# EAGLE design quadcopter_control (EAGLE 5.11)
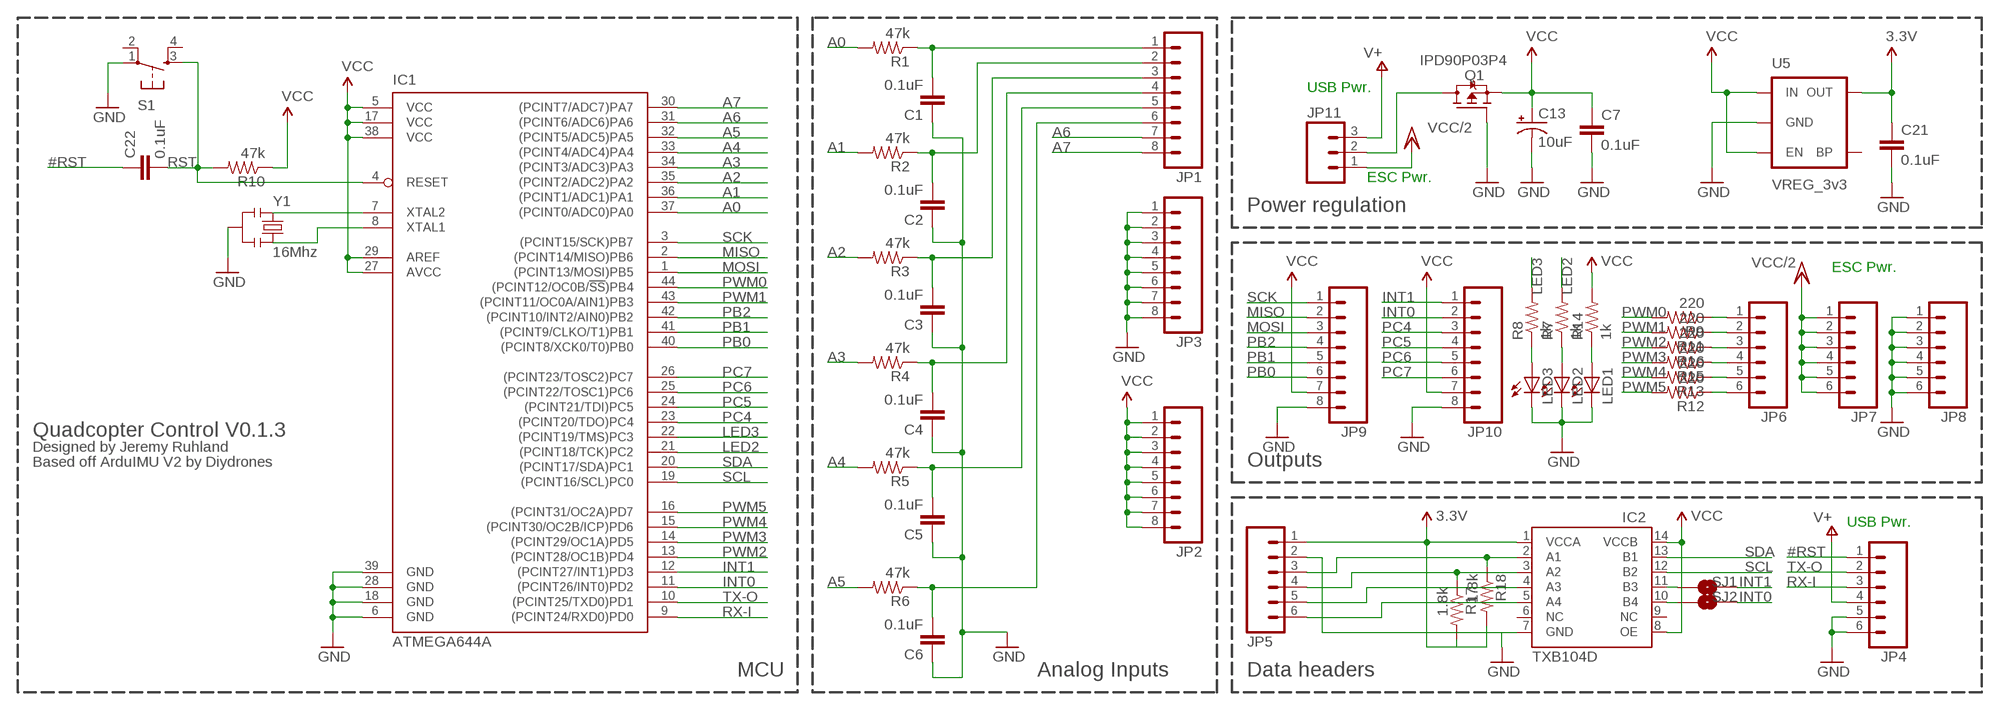
[diagram p0: schematic, sheet 1]

## Parts
C1  0.1uF  CAP0402-CAP  [0402-CAP]
C2  0.1uF  CAP0402-CAP  [0402-CAP]
C3  0.1uF  CAP0402-CAP  [0402-CAP]
C4  0.1uF  CAP0402-CAP  [0402-CAP]
C5  0.1uF  CAP0402-CAP  [0402-CAP]
C6  0.1uF  CAP0402-CAP  [0402-CAP]
C7  0.1uF  CAP0402-CAP  [0402-CAP]
C13  10uF  CAP_POL1206  [EIA3216]
C21  0.1uF  CAP0402-CAP  [0402-CAP]
C22  0.1uF  CAP0402-CAP  [0402-CAP]
IC1  ATMEGA644A  [TQFP44]
IC2  TXB104D  [SOIC(D)-14]
JP1  M081X08  [1X08]
JP2  M081X08  [1X08]
JP3  M081X08  [1X08]
JP4  M06SIP  [1X06]
JP5  M06SIP  [1X06]
JP6  M06SIP  [1X06]
JP7  M06SIP  [1X06]
JP8  M06SIP  [1X06]
JP9  M081X08  [1X08]
JP10  M081X08  [1X08]
JP11  M03LONGPADS  [1X03_LONGPADS]
LED1  LED0603  [LED-0603]
LED2  LED0603  [LED-0603]
LED3  LED0603  [LED-0603]
Q1  IPD90P03P4  FDD4141TO252  [TO252]
R1  47k  RESISTOR0402-RES  [0402-RES]
R2  47k  RESISTOR0402-RES  [0402-RES]
R3  47k  RESISTOR0402-RES  [0402-RES]
R4  47k  RESISTOR0402-RES  [0402-RES]
R5  47k  RESISTOR0402-RES  [0402-RES]
R6  47k  RESISTOR0402-RES  [0402-RES]
R7  1k  RESISTOR0402-RES  [0402-RES]
R8  1k  RESISTOR0402-RES  [0402-RES]
R9  220  RESISTOR0402-RES  [0402-RES]
R10  47k  RESISTOR0402-RES  [0402-RES]
R11  220  RESISTOR0402-RES  [0402-RES]
R12  220  RESISTOR0402-RES  [0402-RES]
R13  220  RESISTOR0402-RES  [0402-RES]
R14  1k  RESISTOR0402-RES  [0402-RES]
R15  220  RESISTOR0402-RES  [0402-RES]
R16  220  RESISTOR0402-RES  [0402-RES]
R17  1.8k  RESISTOR0402-RES  [0402-RES]
R18  1.8k  RESISTOR0402-RES  [0402-RES]
S1  TAC_SWITCHSMD  [TACTILE_SWITCH_SMD]
SJ1  SOLDERJUMPERNC  [SJ_2S]
SJ2  SOLDERJUMPERNC  [SJ_2S]
U5  VREG_3v3  V_REG_LDOSMD  [SOT23-5]
Y1  16Mhz  RESONATORSMD  [RESONATOR-SMD]

## Nets
3.3V: C21.1 IC2.1(VCCA) JP5.1 R17.2 R18.2 U5.5(OUT)
#RST: C22.1 JP4.1
A0: IC1.37((PCINT0/ADC0)PA0) R1.2
A1: IC1.36((PCINT1/ADC1)PA1) R2.2
A2: IC1.35((PCINT2/ADC2)PA2) R3.2
A3: IC1.34((PCINT3/ADC3)PA3) R4.2
A4: IC1.33((PCINT4/ADC4)PA4) R5.2
A5: IC1.32((PCINT5/ADC5)PA5) R6.2
A6: IC1.31((PCINT6/ADC6)PA6) JP1.7
A7: IC1.30((PCINT7/ADC7)PA7) JP1.8
GND: C1.1 C2.1 C3.1 C4.1 C5.1 C6.1 C7.2 C13.C(-) C21.2 IC1.6(GND) IC1.18(GND) IC1.28(GND) IC1.39(GND) IC2.7(GND) JP3.1 JP3.2 JP3.3 JP3.4 JP3.5 JP3.6 JP3.7 JP3.8 JP4.5 JP4.6 JP5.2 JP8.1 JP8.2 JP8.3 JP8.4 JP8.5 JP8.6 JP9.8 JP10.8 LED1.C LED2.C LED3.C Q1.1(G) S1.1 U5.2(GND) Y1.2
INT0: IC1.11((PCINT26/INT0)PD2) JP10.2 SJ2.1
INT1: IC1.12((PCINT27/INT1)PD3) JP10.1 SJ1.1
LED2: IC1.21((PCINT18/TCK)PC2) R7.2
LED3: IC1.22((PCINT19/TMS)PC3) R8.2
MISO: IC1.2((PCINT14/MISO)PB6) JP9.2
MOSI: IC1.1((PCINT13/MOSI)PB5) JP9.3
N$1: C1.2 JP1.1 R1.1
N$2: C2.2 JP1.2 R2.1
N$3: C3.2 JP1.3 R3.1
N$4: C4.2 JP1.4 R4.1
N$5: IC1.8(XTAL1) Y1.3
N$6: C5.2 JP1.5 R5.1
N$7: IC1.7(XTAL2) Y1.1
N$8: C6.2 JP1.6 R6.1
N$9: LED2.A R7.1
N$10: LED3.A R8.1
N$11: JP11.2 Q1.2(D)
N$12: IC2.5(A4) JP5.6
N$13: JP6.3 R16.1
N$14: IC2.4(A3) JP5.5
N$15: IC2.11(B3) SJ1.2
N$16: IC2.10(B4) SJ2.2
N$17: LED1.A R14.1
N$20: IC2.3(A2) JP5.4 R17.1
N$21: IC2.2(A1) JP5.3 R18.1
N$25: JP6.4 R15.1
N$26: JP6.5 R13.1
N$27: JP6.6 R12.1
N$28: JP6.2 R11.1
N$29: JP6.1 R9.1
PB0: IC1.40((PCINT8/XCK0/T0)PB0) JP9.6
PB1: IC1.41((PCINT9/CLKO/T1)PB1) JP9.5
PB2: IC1.42((PCINT10/INT2/AIN0)PB2) JP9.4
PC4: IC1.23((PCINT20/TDO)PC4) JP10.3
PC5: IC1.24((PCINT21/TDI)PC5) JP10.4
PC6: IC1.25((PCINT22/TOSC1)PC6) JP10.5
PC7: IC1.26((PCINT23/TOSC2)PC7) JP10.6
PWM0: IC1.44((PCINT12/OC0B/!SS!)PB4) R9.2
PWM1: IC1.43((PCINT11/OC0A/AIN1)PB3) R11.2
PWM2: IC1.13((PCINT28/OC1B)PD4) R16.2
PWM3: IC1.14((PCINT29/OC1A)PD5) R15.2
PWM4: IC1.15((PCINT30/OC2B/ICP)PD6) R13.2
PWM5: IC1.16((PCINT31/OC2A)PD7) R12.2
RST: C22.2 IC1.4(RESET) R10.2 S1.3
RX-I: IC1.9((PCINT24/RXD0)PD0) JP4.3
SCK: IC1.3((PCINT15/SCK)PB7) JP9.1
SCL: IC1.19((PCINT16/SCL)PC0) IC2.12(B2)
SDA: IC1.20((PCINT17/SDA)PC1) IC2.13(B1)
TX-O: IC1.10((PCINT25/TXD0)PD1) JP4.2
V+: JP4.4 JP11.3
VCC: C7.1 C13.A(+) IC1.5(VCC) IC1.17(VCC) IC1.27(AVCC) IC1.29(AREF) IC1.38(VCC) IC2.8(OE) IC2.14(VCCB) JP2.1 JP2.2 JP2.3 JP2.4 JP2.5 JP2.6 JP2.7 JP2.8 JP9.7 JP10.7 Q1.3(S) R10.1 R14.2 U5.1(IN) U5.3(EN)
VCC/2: JP7.1 JP7.2 JP7.3 JP7.4 JP7.5 JP7.6 JP11.1
Unconnected: IC2.6(NC) IC2.9(NC) S1.2 S1.4 U5.4(BP)

## Notes on the sheet
- USB Pwr.
- ESC Pwr.
- Power regulation
- ESC Pwr.
- Quadcopter Control V0.1.3
- Designed by Jeremy Ruhland
- Based off ArduIMU V2 by Diydrones | Outputs
- USB Pwr.
- MCU | Analog Inputs | Data headers

## Library data of the parts
C1-C7 C21 C22 = SparkFun:CAP: Capacitor Standard 0603 ceramic capacitor, and 0.1" leaded capacitor.
C13 = SparkFun:CAP_POL: Capacitor Polarized These are standard SMD and PTH capacitors. Normally 10uF, 47uF, and 100uF in electrolytic and tantalum varieties. Always verify the external diameter of the through hole cap, it varies with capacity, voltage, and manufacturer. The EIA devices should be standard.
IC1 = atmel:ATMEGA644: 8-bit Microcontroller with 64K Bytes In-System Programmable Flash Source: http://www.atmel.com/dyn/resources/prod_documents/doc2593.pdf; MPN: ATMEGA644PV-10AU; OC_FARNELL: 1455123; OC_NEWARK: 58M3748
IC2 = ti_txb0104:TXB104
JP1-JP3 JP9 JP10 = SparkFun:M08: Header 8 Standard 8-pin 0.1" header. Use with straight break away headers (SKU : PRT-00116), right angle break away headers (PRT-00553), swiss pins (PRT-00743), machine pins (PRT-00117), and female headers (PRT-00115).
JP4-JP8 = SparkFun:M06: Header 6 Standard 6-pin 0.1" header. Use with straight break away headers (SKU : PRT-00116), right angle break away headers (PRT-00553), swiss pins (PRT-00743), machine pins (PRT-00117), and female headers (PRT-00115). Molex polarized connector foot print use with SKU : PRT-08094 with associated crimp pins and housings. NOTES ON THE VARIANTS LOCK and LOCK_LONGPADS... This footprint was designed to help hold the alignment of a through-hole component (i.e. 6-pin header) while soldering it into place. You may notice that each hole has been shifted either up or down by 0.005 of an inch from it's more standard position (which is a perfectly straight line). This slight alteration caused the pins (the squares in the middle) to touch the edges of the holes. Because they are alternating, it causes a "brace" to hold the component in place. 0.005 has proven to be the perfect amount of "off-center" position when using our standard breakaway headers. Although looks a little odd when you look at the bare footprint, once you have a header in there, the alteration is very hard to notice. Also, if you push a header all the way into place, it is covered up entirely on the bottom side. This idea of altering the position of holes to aid alignment will be further integrated into the Sparkfun Library for other footprints. It can help hold any component with 3 or more connection pins.
JP11 = SparkFun:M03: Header 3 Standard 3-pin 0.1" header. Use with straight break away headers (SKU : PRT-00116), right angle break away headers (PRT-00553), swiss pins (PRT-00743), machine pins (PRT-00117), and female headers (PRT-00115). Molex polarized connector foot print use with SKU : PRT-08232 with associated crimp pins and housings.
LED1-LED3 = DIYdrones3:LED: LEDs Standard schematic elements and footprints for 5mm, 3mm, 1206, and 0603 sized LEDs. 5mm - Spark Fun Electronics SKU : COM-00529 (and others)
Q1 = transistor-fet:FDD4141: P-Channel PowerTrench® MOSFET Source: FDD4141.pdf
R1-R18 = SparkFun:RESISTOR: Resistor Basic schematic elements and footprints for 0603, 1206, and PTH resistors.
S1 = SparkFun:TAC_SWITCH: Momentary Switch Button commonly used for reset or general input. Spark Fun Electronics SKU : COM-00097
SJ1 SJ2 = SparkFun:SOLDERJUMPER: Solder Jumper Standard SMD solder jumper. Used to automate production. Two varients : Normally Open and Normally Closed are the same, but have different paste layers. NC will have a large amount of paste and should jumper during reflow.
U5 = DIYdrones3:V_REG_LDO: Voltage Regulator LDO Standard 150mA LDO voltage regulator in SOT-23 layout. Micrel part MIC5205. BP (by-pass) pin is used to lower output noise with 470pF cap.
Y1 = DIYdrones3:RESONATOR: Resonator Small SMD resonator. This is the itty bitty 10/20MHz resonators with built in caps. CSTCE10M0G55 and CSTCE20M0V53. Footprint has been reviewed closely but hasn't been tested yet.

## Board
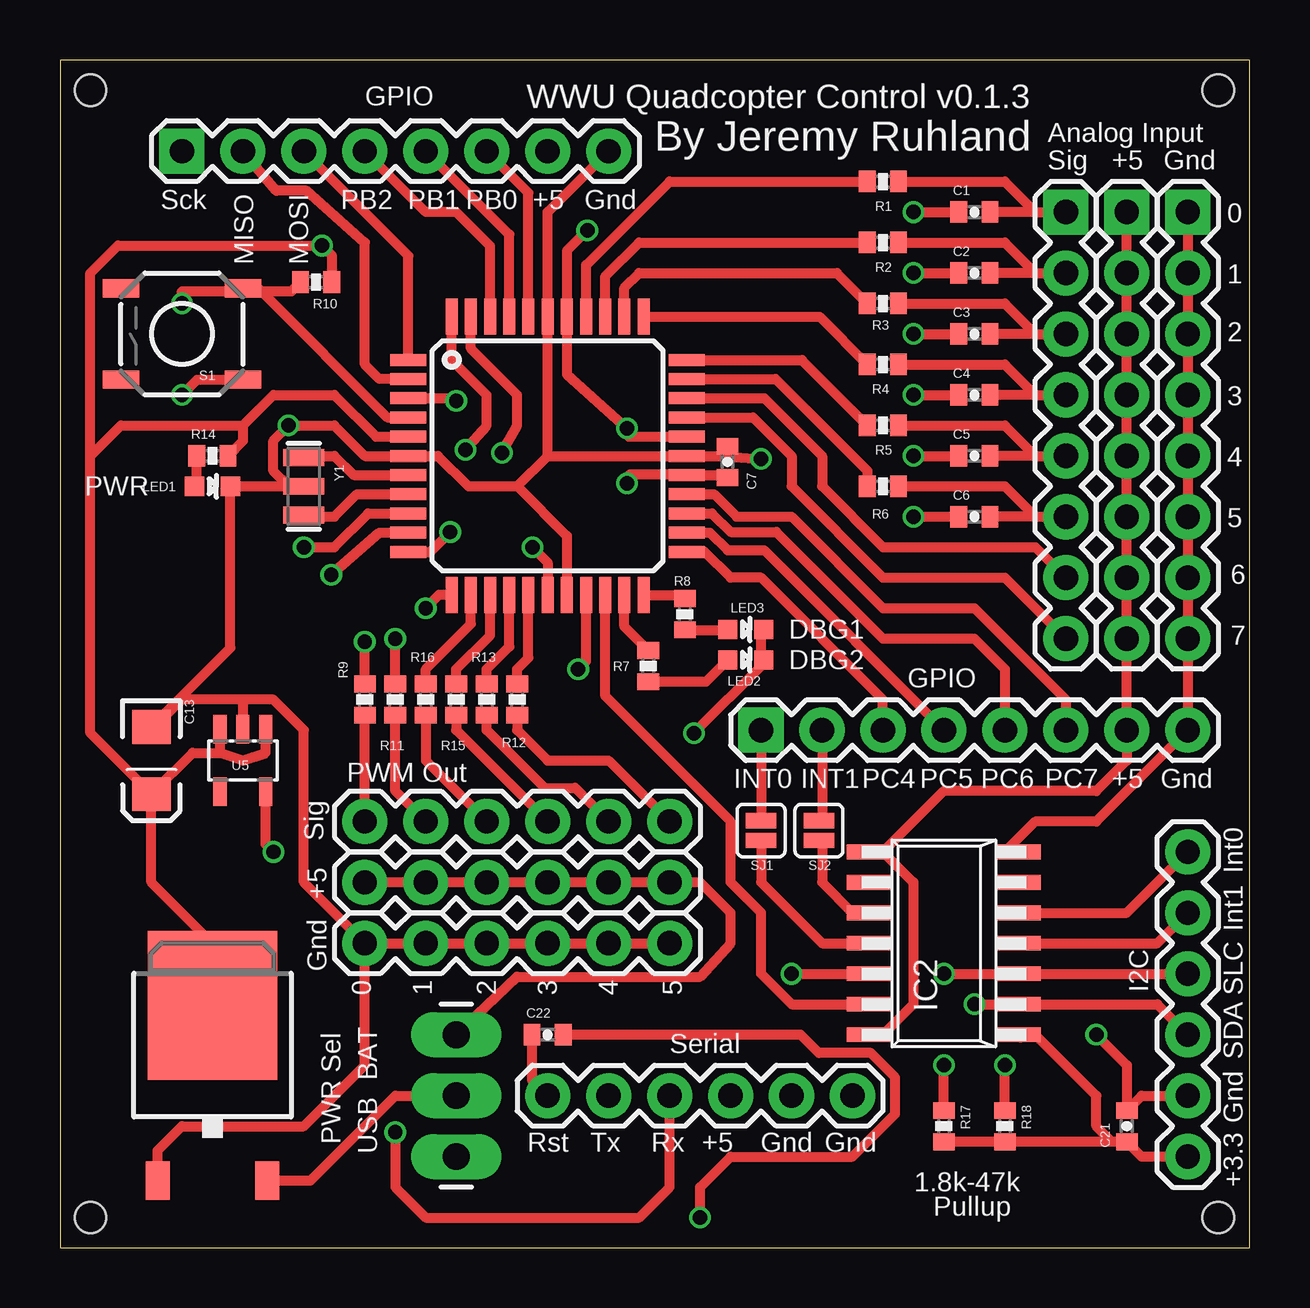
[diagram p1: board, top side]
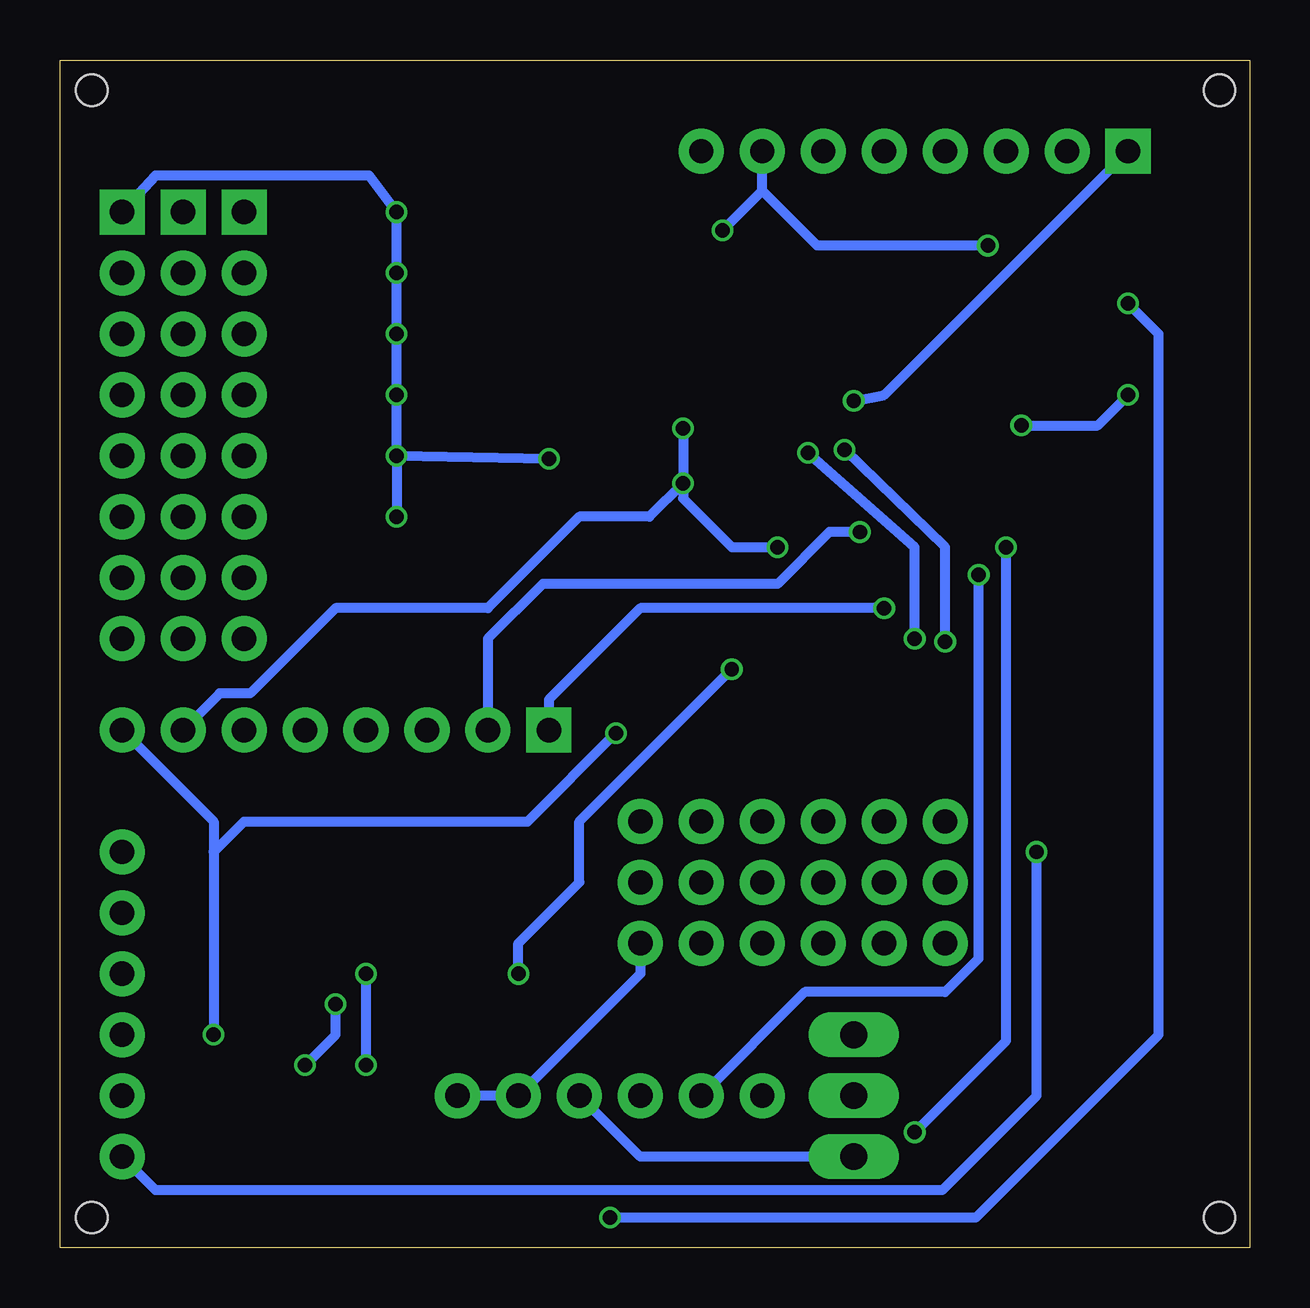
[diagram p2: board, bottom side, seen from below]

Size 49.58 x 49.52 mm. Coordinates in mm from the lower left corner, seen from the top.
Outline: 0,0 49.58,0 49.58,49.52 0,49.52 0,0
Copper layers (1*16): Top 0.035mm / dielectric 1.5mm / Bottom 0.035mm
Design rules "ITead_rule": minimum track width 6mil, minimum drill 12mil, track to track 6mil, track to pad 6mil, pad to pad 6mil, via to via 6mil, smd to smd 0mil, copper to edge 10mil, drill to drill 10mil, minimum pad ring 10mil, minimum via ring 6mil, stop-mask expansion 2mil, vias tented up to drill 100mil, thermal gap 10mil
Holes 1.3 mm at 1.27,48.26 48.26,48.26 48.26,1.27 1.27,1.27

### Footprints (pad centres in the part's own frame; a part is rotated, then mirrored left to right if it is on the bottom)
0402-CAP = smd 0.7 x 0.9: 1 -0.65,0; 2 0.65,0
EIA3216 = smd 1.4 x 1.6: A 1.4,0; C -1.4,0
TQFP44 = smd 1.5 x 0.5: 1 -5.8,4; 2 -5.8,3.2; 3 -5.8,2.4; 4 -5.8,1.6; 5 -5.8,0.8; 6 -5.8,0; 7 -5.8,-0.8; 8 -5.8,-1.6; 9 -5.8,-2.4; 10 -5.8,-3.2; 11 -5.8,-4; 23 5.8,-4; 24 5.8,-3.2; 25 5.8,-2.4; 26 5.8,-1.6; 27 5.8,-0.8; 28 5.8,0; 29 5.8,0.8; 30 5.8,1.6; 31 5.8,2.4; 32 5.8,3.2; 33 5.8,4 | smd 0.5 x 1.5: 12 -4,-5.8; 13 -3.2,-5.8; 14 -2.4,-5.8; 15 -1.6,-5.8; 16 -0.8,-5.8; 17 0,-5.8; 18 0.8,-5.8; 19 1.6,-5.8; 20 2.4,-5.8; 21 3.2,-5.8; 22 4,-5.8; 34 4,5.8; 35 3.2,5.8; 36 2.4,5.8; 37 1.6,5.8; 38 0.8,5.8; 39 0,5.8; 40 -0.8,5.8; 41 -1.6,5.8; 42 -2.4,5.8; 43 -3.2,5.8; 44 -4,5.8
SOIC(D)-14 = smd 0.61 x 1.93: 1 -3.81,-3.076; 2 -2.54,-3.076; 3 -1.27,-3.076; 4 0,-3.076; 5 1.27,-3.076; 6 2.54,-3.076; 7 3.81,-3.076; 8 3.81,3.076; 9 2.54,3.076; 10 1.27,3.076; 11 0,3.076; 12 -1.27,3.076; 13 -2.54,3.076; 14 -3.81,3.076
1X08 = drill 1.016 pad 1.88 square: 1 0,0 | drill 1.016 pad 1.88 round: 2 2.54,0; 3 5.08,0; 4 7.62,0; 5 10.16,0; 6 12.7,0; 7 15.24,0; 8 17.78,0
1X06 = drill 1.016 pad 1.88 round: 1 0,0; 2 2.54,0; 3 5.08,0; 4 7.62,0; 5 10.16,0; 6 12.7,0
1X03_LONGPADS = drill 1.118 pad 1.88 long: 1 0,0; 2 2.54,0; 3 5.08,0
LED-0603 = smd 0.8 x 0.8: A 0,-0.75; C 0,0.75
TO252 = smd 1 x 1.6: 1 -2.28,-4.8; 2 2.28,-4.8 | smd 5.4 x 6.2: 3 0,2.5
0402-RES = smd 0.7 x 0.9: 1 -0.65,0; 2 0.65,0
TACTILE_SWITCH_SMD = smd 1.524 x 0.762: 1 -2.54,1.905; 2 2.54,1.905; 3 -2.54,-1.905; 4 2.54,-1.905
SJ_2S = smd 0.635 x 1.27: 1 -0.412,0; 2 0.412,0
SOT23-5 = smd 0.55 x 1.2: 1 -0.95,-1.3; 2 0,-1.3; 3 0.95,-1.3; 4 0.95,1.3; 5 -0.95,1.3
RESONATOR-SMD = smd 0.7 x 1.7: 1 -1.2,0; 2 0,0; 3 1.2,0

### Placement (x,y rotation side)
C1  38.1,43.18 0 top
C2  38.1,40.64 0 top
C3  38.1,38.1 0 top
C4  38.1,35.56 0 top
C5  38.1,33.02 0 top
C6  38.1,30.48 0 top
C7  27.81,32.77 90 top
C13  3.81,20.32 270 top
C21  44.45,5.08 90 top
C22  20.32,8.89 0 top
IC1  20.32,33.02 0 top
IC2  36.83,12.7 90 top
JP1  41.91,43.18 270 top
JP2  44.45,43.18 270 top
JP3  46.99,43.18 270 top
JP4  20.32,6.35 0 top
JP5  46.99,3.81 90 top
JP6  12.7,17.78 0 top
JP7  12.7,15.24 0 top
JP8  12.7,12.7 0 top
JP9  5.08,45.72 0 top
JP10  29.21,21.59 0 top
JP11  16.51,8.89 270 top
LED1  6.35,31.75 270 top
LED2  28.57,24.51 270 top
LED3  28.57,25.78 270 top
Q1  6.35,7.62 0 top
R1  34.29,44.45 180 top
R2  34.29,41.91 180 top
R3  34.29,39.37 180 top
R4  34.29,36.83 180 top
R5  34.29,34.29 180 top
R6  34.29,31.75 180 top
R7  24.51,24.26 90 top
R8  26.04,26.42 90 top
R9  12.7,22.86 90 top
R10  10.67,40.26 180 top
R11  13.97,22.86 90 top
R12  19.05,22.86 90 top
R13  17.78,22.86 90 top
R14  6.35,33.02 0 top
R15  16.51,22.86 90 top
R16  15.24,22.86 90 top
R17  36.83,5.08 270 top
R18  39.37,5.08 270 top
S1  5.08,38.1 180 top
SJ1  29.21,17.4 270 top
SJ2  31.62,17.4 270 top
U5  7.62,20.32 180 top
Y1  10.16,31.75 270 top

### Tracks (layer width: path | path; a pad name or v marks a point on that pad's centre or on a via)
3.3V  (via drill 0.6)
  Top 0.406: U5.5 8.57,16.83 v8.89,16.51 | 40.02,8.78 IC2.1 40.64,8.89 43.18,6.35 43.18,5.08 43.83,4.43 C21.1 | C21.1 45.07,3.81 JP5.1 | R18.2 R17.2 | R18.2 39.37,4.45 | C21.1 44.45,4.45 44.44,4.43 R18.2
  Bottom 0.406: v8.89,16.51 8.89,6.35 12.83,2.41 45.59,2.41 JP5.1
#RST
  Top 0.406: JP4.1 19.67,7 C22.1
A0
  Top 0.406: IC1.37 21.92,40.97 25.4,44.45 R1.2
A1
  Top 0.406: IC1.36 22.72,40.5 24.13,41.91 R2.2
A2
  Top 0.406: IC1.35 23.52,40.03 24.13,40.64 32.37,40.64 R3.2
A3
  Top 0.406: IC1.34 31.65,38.82 R4.2
A4
  Top 0.406: IC1.33 30.91,37.02 R5.2
A5
  Top 0.406: IC1.32 29.82,36.22 33.64,32.4 R6.2
A6
  Top 0.406: IC1.31 29.35,35.42 31.75,33.02 31.75,31.75 34.29,29.21 40.64,29.21 JP1.7
A7
  Top 0.406: IC1.30 28.88,34.62 30.48,33.02 30.48,31.75 34.29,27.94 39.37,27.94 JP1.8
GND  (via drill 0.6)
  Top 0.406: JP3.1 JP3.2 JP3.3 JP3.4 JP3.5 JP3.6 JP3.7 JP3.8 JP10.8 43.18,17.78 40.64,17.78 39.37,16.51 IC2.7 | JP8.1 JP8.2 JP8.3 JP8.4 JP8.5 JP8.6 | 7.62,22.86 U5.2 | 4.95,22.86 C13.C | 7.62,22.86 4.95,22.86 | 7.62,22.86 8.89,22.86 10.16,21.59 10.16,15.24 JP8.1 | 20.32,33.02 IC1.39 20.32,43.18 JP9.8 | 19.05,31.75 20.32,33.02 | 19.05,31.75 17.02,31.75 15.75,33.02 IC1.6 12.7,33.02 11.43,34.29 v9.53,34.29 8.89,33.66 8.89,32.38 9.53,31.75 Y1.2 LED1.C 7.1,25.01 C13.C | 20.32,33.02 IC1.28 27.54,33.02 | 27.54,33.02 C7.2 | v35.56,30.48 C6.1 | v35.56,33.02 C5.1 | v35.56,35.56 C4.1 | v35.56,38.1 C3.1 | v35.56,40.64 C2.1 | 27.54,33.02 v29.21,32.89 | S1.1 5.71,36.2 v5.08,35.56 | Q1.1 4.07,4.07 5.08,5.08 10.16,5.08 12.7,7.62 JP8.1 | v35.56,43.18 C1.1 | IC1.18 21.12,29.68 19.05,31.75 | v43.18,8.89 44.45,7.62 C21.2 45.07,6.35 JP5.2 | 4.95,22.86 4.95,22.73 3.81,21.59 C13.C | LED3.C 29.21,25.67 29.21,24.63 LED2.C 29.32,24.37 v26.42,21.46
  Bottom 0.406: v35.56,33.02 v35.56,30.48 | v35.56,33.02 v35.56,35.56 v35.56,38.1 v35.56,40.64 v35.56,43.18 36.7,44.7 45.59,44.7 JP3.1 | v29.21,32.89 v35.56,33.02 | v9.53,34.29 6.35,34.29 v5.08,35.56 | JP4.6 JP4.5 25.4,11.43 JP8.6 | 43.18,16.51 43.18,17.78 JP10.8 | 43.18,16.51 v43.18,8.89 | 43.18,16.51 41.91,17.78 30.1,17.78 v26.42,21.46
INT0  (via drill 0.6)
  Top 0.406: SJ2.1 31.75,17.81 JP10.2 | IC1.11 15.43,29.02 v16.26,29.84
  Bottom 0.406: v16.26,29.84 17.53,29.84 19.68,27.69 29.46,27.69 31.75,25.4 JP10.2
INT1  (via drill 0.6)
  Top 0.406: JP10.1 SJ1.1 | IC1.12 15.79,27.22 v15.24,26.67
  Bottom 0.406: v15.24,26.67 25.4,26.67 29.21,22.86 JP10.1
LED2
  Top 0.406: IC1.21 23.52,25.9 R7.2
LED3
  Top 0.406: IC1.22 25.88,27.22 R8.2
MISO
  Top 0.406: IC1.2 13.31,36.22 12.7,36.83 12.7,41.91 10.29,44.07 9.02,44.07 JP9.2
MOSI
  Top 0.406: IC1.1 14.52,41.36 JP9.3
N$1
  Top 0.406: 40.64,43.18 C1.2 | 40.64,43.18 JP1.1 | R1.1 39.37,44.45 40.64,43.18
N$2
  Top 0.406: 40.64,40.64 C2.2 | 40.64,40.64 JP1.2 | R2.1 39.37,41.91 40.64,40.64
N$3
  Top 0.406: 40.64,38.1 C3.2 | 40.64,38.1 JP1.3 | R3.1 39.37,39.37 40.64,38.1
N$4
  Top 0.406: 40.64,35.56 C4.2 | 40.64,35.56 JP1.4 | R4.1 39.37,36.83 40.64,35.56
N$5
  Top 0.406: IC1.8 12.37,31.42 11.43,30.48 10.23,30.48 Y1.3
N$6
  Top 0.406: 40.64,33.02 C5.2 | 40.64,33.02 JP1.5 | R5.1 39.37,34.29 40.64,33.02
N$7
  Top 0.406: IC1.7 12.23,32.22 11.43,33.02 10.23,33.02 Y1.1
N$8
  Top 0.406: 40.64,30.48 C6.2 | 40.64,30.48 JP1.6 | R6.1 39.37,31.75 40.64,30.48
N$9
  Top 0.406: R7.1 26.92,23.61 LED2.A
N$10
  Top 0.406: R8.1 27.81,25.77 LED3.A
N$11
  Top 0.406: Q1.2 10.44,2.82 13.97,6.35 JP11.2
N$12
  Top 0.406: JP5.6 44.45,13.97 IC2.5
N$13
  Top 0.406: JP6.3 15.24,20.32 R16.1
N$14
  Top 0.406: IC2.4 45.72,12.7 JP5.5
N$15
  Top 0.406: IC2.11 31.75,12.7 29.21,15.24 SJ1.2
N$16
  Top 0.406: IC2.10 33.02,13.97 31.75,15.24 31.75,16.86 SJ2.2
N$17
  Top 0.406: R14.1 5.7,31.85 LED1.A
N$20  (via drill 0.6)
  Top 0.406: JP5.4 IC2.3 v36.83,11.43 | R17.1 v36.83,7.62
  Bottom 0.406: v36.83,7.62 v36.83,11.43
N$21  (via drill 0.6)
  Top 0.406: JP5.3 45.72,10.16 IC2.2 v38.1,10.16 | 39.37,5.71 R18.1 v39.37,7.62
  Bottom 0.406: v38.1,10.16 38.1,8.89 v39.37,7.62
N$25
  Top 0.406: JP6.4 16.51,21.59 R15.1
N$26
  Top 0.406: R13.1 17.78,21.59 20.19,19.18 21.46,19.18 JP6.5
N$27
  Top 0.406: JP6.6 22.86,20.32 20.32,20.32 19.05,21.59 R12.1
N$28
  Top 0.406: JP6.2 13.97,19.05 R11.1
N$29
  Top 0.406: JP6.1 R9.1
PB0
  Top 0.406: IC1.40 19.52,43.98 JP9.6
PB1
  Top 0.406: IC1.41 18.72,42.24 JP9.5
PB2
  Top 0.406: IC1.42 17.92,41.77 16.51,43.18 15.24,43.18 JP9.4
PC4
  Top 0.406: JP10.3 34.29,22.86 29.21,27.94 27.94,27.94 26.86,29.02 IC1.23
PC5
  Top 0.406: JP10.4 29.34,29.08 27.81,29.08 27.08,29.82 IC1.24
PC6
  Top 0.406: JP10.5 39.37,24.13 38.1,25.4 34.29,25.4 29.84,29.84 27.94,29.84 27.16,30.62 IC1.25
PC7
  Top 0.406: JP10.6 41.91,22.86 38.1,26.67 34.29,26.67 30.48,30.48 28.19,30.48 27.25,31.42 IC1.26
PWM0  (via drill 0.6)
  Top 0.406: R9.2 v12.7,25.27 | v16.89,33.27 17.78,34.29 17.78,35.56 16.32,37.02 IC1.44
  Bottom 0.406: v12.7,25.27 12.7,29.21 v16.89,33.27
PWM1  (via drill 0.6)
  Top 0.406: R11.2 v13.97,25.4 | v18.41,33.15 19.05,34.29 19.05,35.56 17.12,37.49 IC1.43
  Bottom 0.406: v13.97,25.4 13.97,29.21 v18.41,33.15
PWM2
  Top 0.406: IC1.13 17.12,26.01 15.24,24.13 R16.2
PWM3
  Top 0.406: IC1.14 17.92,25.54 16.51,24.13 R15.2
PWM4
  Top 0.406: IC1.15 18.72,25.07 17.78,24.13 R13.2
PWM5
  Top 0.406: IC1.16 19.52,24.6 19.05,24.13 R12.2
RST  (via drill 0.6)
  Top 0.406: 8.38,39.88 8.26,40.01 S1.3 | IC1.4 13.64,34.62 8.38,39.88 | 8.38,39.88 5.08,39.88 v5.08,39.37 | 8.38,39.88 9.64,39.88 R10.2 | v26.67,1.27 26.67,2.54 27.94,3.81 33.02,3.81 34.8,5.59 34.8,7.11 33.78,8.13 31.62,8.13 30.86,8.89 C22.2
  Bottom 0.406: v5.08,39.37 3.81,38.1 3.81,8.89 11.43,1.27 v26.67,1.27
RX-I  (via drill 0.6)
  Top 0.406: IC1.9 12.84,30.62 11.43,29.21 v10.16,29.21 | v13.97,4.83 13.97,2.54 15.24,1.27 24.13,1.27 25.4,2.54 JP4.3
  Bottom 0.406: v10.16,29.21 10.16,8.64 v13.97,4.83
SCK  (via drill 0.6)
  Top 0.406: IC1.3 16.37,35.42 v16.51,35.31
  Bottom 0.406: v16.51,35.31 15.24,35.56 JP9.1
SCL  (via drill 0.6)
  Top 0.406: v21.59,24.13 21.92,24.46 IC1.19 | v30.48,11.43 IC2.12
  Bottom 0.406: v21.59,24.13 27.94,17.78 27.94,15.24 30.48,12.7 v30.48,11.43
SDA
  Top 0.406: IC1.20 22.72,23 27.94,17.78 27.94,15.24 29.21,13.97 29.21,11.43 30.48,10.16 IC2.13
TX-O  (via drill 0.6)
  Top 0.406: IC1.10 13.31,29.82 v11.3,28.07
  Bottom 0.406: v11.3,28.07 11.3,12.06 12.7,10.67 18.54,10.67 JP4.2
V+
  Bottom 0.406: JP11.3 25.4,3.81 JP4.4
VCC  (via drill 0.6)
  Top 0.406: JP2.1 JP2.2 JP2.3 JP2.4 JP2.5 JP2.6 JP2.7 JP2.8 JP10.7 44.45,20.32 43.18,19.05 36.83,19.05 34.29,16.51 | 6.67,20.64 U5.3 | 6.67,20.64 7.62,20.32 8.57,20.64 U5.1 | C13.A 5.53,20.64 6.67,20.64 | IC1.29 23.71,33.82 v23.62,34.16 21.12,36.41 IC1.38 21.12,41.57 v21.97,42.42 | v23.62,31.88 23.75,32.26 26.08,32.26 IC1.27 27.58,32.22 C7.1 | C13.A 3.81,15.24 6.35,12.7 Q1.3 6.35,8.89 | IC1.17 20.32,28.57 v19.68,29.21 | IC1.5 13.17,33.82 11.43,35.56 8.89,35.56 7.62,34.29 | 7.62,34.29 7.62,33.64 R14.2 | 1.27,33.02 2.54,34.29 7.62,34.29 | 1.27,33.02 1.27,21.46 C13.A | 1.27,33.02 1.27,40.64 2.41,41.78 v10.92,41.78 11.32,41.39 R10.1 | 34.29,16.51 IC2.8 | 34.29,16.51 35.56,15.24 35.56,10.16 34.29,8.89 IC2.14
  Bottom 0.406: v23.62,34.16 v23.62,31.88 | v23.62,31.88 25.02,30.48 27.94,30.48 31.75,26.67 38.1,26.67 41.66,23.11 42.93,23.11 JP10.7 | v23.62,31.88 23.62,31.24 21.59,29.21 v19.68,29.21 | 20.32,44.07 v21.97,42.42 | 20.32,44.07 JP9.7 | v10.92,41.78 18.03,41.78 20.32,44.07
VCC/2
  Top 0.406: JP11.1 19.05,11.3 26.67,11.3 27.94,12.7 27.94,13.97 26.67,15.24 JP7.6 JP7.5 JP7.4 JP7.3 JP7.2 JP7.1

### Text on the board
_tsilk: GPIO | WWU Quadcopter Control v0.1.3 | By Jeremy Ruhland | Analog Input | Sig | +5 | Gnd | MISO | MOSI | 0 | Sck | PB2 | PB1 | PB0 | +5 | Gnd | 1 | 2 | 3 | 4 | PWR | 5 | 6 | DBG1 | 7 | DBG2 | GPIO | Sig | PWM Out | INT0 | INT1 | PC4 | PC5 | PC6 | PC7 | +5 | Gnd | +5 | Int0 | Gnd | Int1 | 0 | 1 | 2 | 3 | 4 | 5 | I2C | SLC | Serial | SDA | BAT | Rst | Tx | Rx | +5 | Gnd | Gnd | Gnd | PWR Sel | USB | 1.8k-47k | +3.3 | Pullup